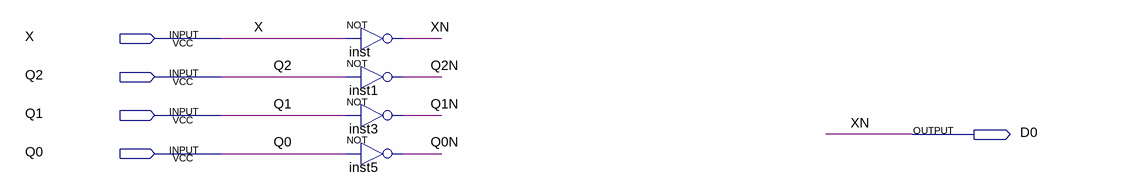
[diagram p0: schematic sheet]
// Quartus schematic D0.bdf as structural Verilog: 4 symbols, 5 pins
module D0 (
  input  X,
  input  Q2,
  input  Q1,
  input  Q0,
  output D0
);

  wire Q0N, Q1N, Q2N;

  not inst (D0, X);
  not inst1 (Q2N, Q2);
  not inst3 (Q1N, Q1);
  not inst5 (Q0N, Q0);

  // Other names for the same wires on the sheet: XN = D0
endmodule
